# EAGLE design wifi_prod (EAGLE 6.3)
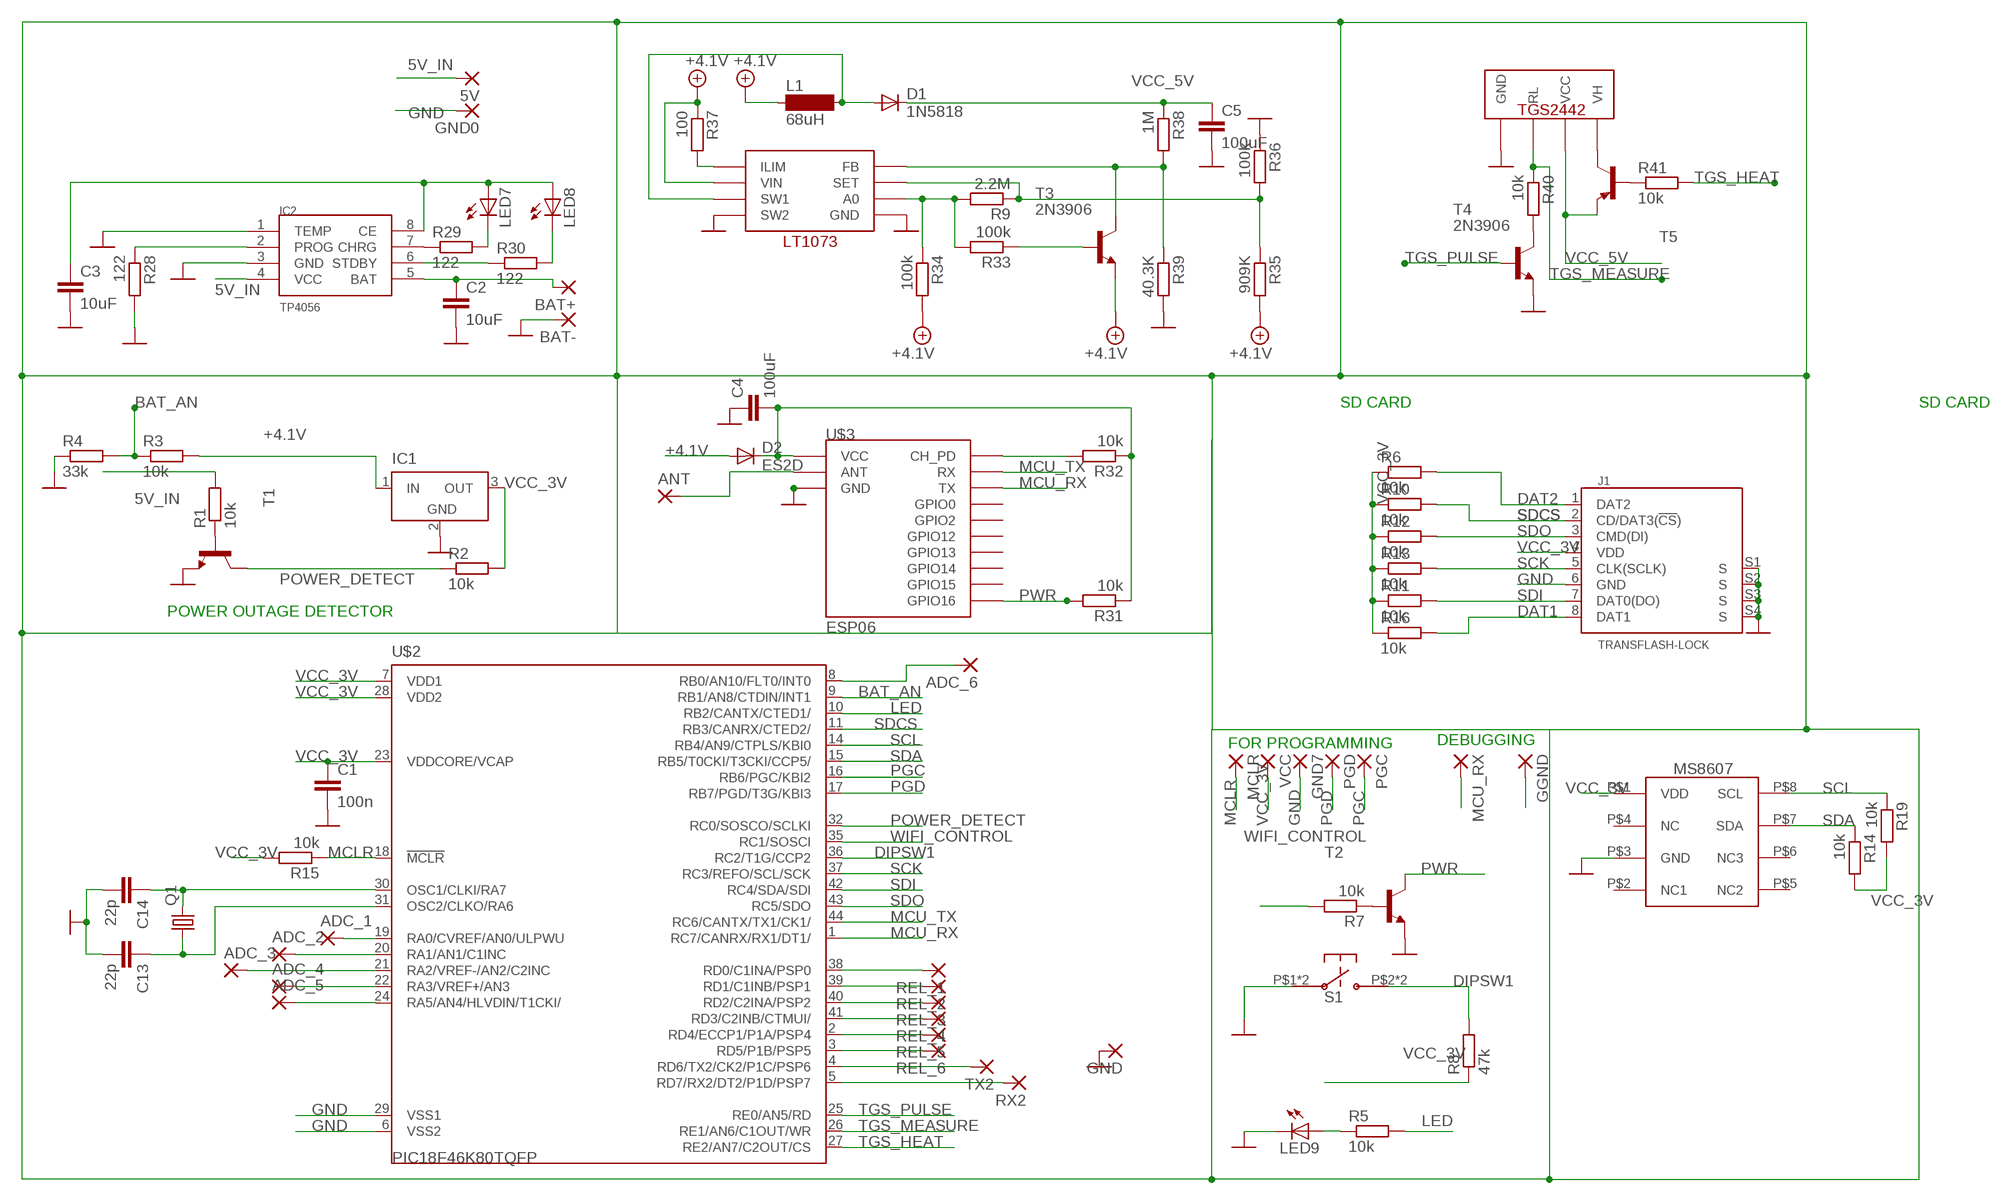
[diagram p0: schematic, sheet 1]

## Parts
5V  2,15/1,0  [2,15/1,0]
ADC_1  1,6/0,8  [1,6/0,8]
ADC_2  1,6/0,8  [1,6/0,8]
ADC_3  1,6/0,8  [1,6/0,8]
ADC_4  1,6/0,8  [1,6/0,8]
ADC_5  1,6/0,8  [1,6/0,8]
ADC_6  1,6/0,8  [1,6/0,8]
ANT  SMD2  [SMD1,27-2,54]
BAT+  2,15/1,0  [2,15/1,0]
BAT-  2,15/1,0  [2,15/1,0]
C1  100n  C-EUC0603  [C0603]
C2  10uF  C-EUC1206K  [C1206K]
C3  10uF  C-EUC1206K  [C1206K]
C4  100uF  C-EUC1206K  [C1206K]
C5  100uF  C-EUC1206K  [C1206K]
C13  22p  C-EUC1206K  [C1206K]
C14  22p  C-EUC1206K  [C1206K]
D1  1N5818  PMLL4150  [SOD80C]
D2  ES2D  [SMB]
GGND  2,15/1,0  [2,15/1,0]
GND  2,15/1,0  [2,15/1,0]
GND0  2,15/1,0  [2,15/1,0]
GND7  2,15/1,0  [2,15/1,0]
IC1  LT1129CST5  [SOT223]
IC2  TP4056  [SOP-8]
J1  TRANSFLASH-LOCK  [TRANSFLASH-LOCK-SOCK]
L1  68uH  MS85  [MS85]
LED7  LG_T679-E1F1-1  [PLCC2]
LED8  LG_T679-E1F1-1  [PLCC2]
LED9  LG_T679-E1F1-1  [PLCC2]
MCLR  2,15/1,0  [2,15/1,0]
MCU_RX  2,15/1,0  [2,15/1,0]
PGC  2,15/1,0  [2,15/1,0]
PGD  2,15/1,0  [2,15/1,0]
Q1  CRYSTALHC49S  [HC49/S]
R1  10k  R-EU_R0603  [R0603]
R2  10k  R-EU_R0603  [R0603]
R3  10k  R-EU_R0603  [R0603]
R4  33k  R-EU_R0603  [R0603]
R5  10k  R-EU_R0603  [R0603]
R6  10k  R-EU_R0603  [R0603]
R7  10k  R-EU_R0603  [R0603]
R8  47k  R-EU_R0603  [R0603]
R9  2.2M  R-EU_R0603  [R0603]
R10  10k  R-EU_R0603  [R0603]
R11  10k  R-EU_R0603  [R0603]
R12  10k  R-EU_R0603  [R0603]
R13  10k  R-EU_R0603  [R0603]
R14  10k  R-EU_R0603  [R0603]
R15  10k  R-EU_R0603  [R0603]
R16  10k  R-EU_R0603  [R0603]
R19  10k  R-EU_R0603  [R0603]
R28  122  R-EU_R0603  [R0603]
R29  122  R-EU_R0603  [R0603]
R30  122  R-EU_R0603  [R0603]
R31  10k  R-EU_R0603  [R0603]
R32  10k  R-EU_R0603  [R0603]
R33  100k  R-EU_R0603  [R0603]
R34  100k  R-EU_R0603  [R0603]
R35  909K  R-EU_R0603  [R0603]
R36  100k  R-EU_R0603  [R0603]
R37  100  R-EU_R0603  [R0603]
R38  1M  R-EU_R0603  [R0603]
R39  40.3K  R-EU_R0603  [R0603]
R40  10k  R-EU_R0603  [R0603]
R41  10k  R-EU_R0603  [R0603]
REL_1  1,6/0,8  [1,6/0,8]
REL_2  1,6/0,8  [1,6/0,8]
REL_3  1,6/0,8  [1,6/0,8]
REL_4  1,6/0,8  [1,6/0,8]
REL_5  1,6/0,8  [1,6/0,8]
REL_6  1,6/0,8  [1,6/0,8]
RX2  2,15/1,0  [2,15/1,0]
S1  EVQP2  [EVQP2]
T1  BC849  [SOT23]
T2  BC849  [SOT23]
T3  2N3906  BC847  [SOT23]
T4  2N3906  BC847  [SOT23]
T5  -PNP-SOT23-BCE  [SOT23-BCE]
TX2  2,15/1,0  [2,15/1,0]
U$1  LT1073  [LT1073]
U$2  PIC18F46K80TQFP  [TQFP44]
U$3  ESP06  [ESP06]
U$4  TGS2442  [TGS2442]
U$6  MS8607  [MS8607]
VCC  2,15/1,0  [2,15/1,0]

## Nets
5V_IN: 5V.1(P) C3.1 IC2.4(VCC) IC2.8(CE) LED7.A LED8.A R1.2
+4.1V: BAT+.1(P) C2.1 D2.A IC1.1(IN) IC2.5(BAT) L1.1 R3.2 R34.2 R35.2 R37.1 T3.2(E) U$1.P$2(VIN)
BAT_AN: R3.1 R4.2 U$2.9(RB1/AN8/CTDIN/INT1)
DAT1: J1.8(DAT1) R16.2
DAT2: J1.1(DAT2) R6.2
DIPSW1: R8.2 S1.P$2 S1.P$4 U$2.36(RC2/T1G/CCP2)
GND: BAT-.1(P) C1.2 C2.2 C3.2 C4.1 C5.2 C13.2 C14.2 GGND.1(P) GND0.1(P) GND7.1(P) GND.1(P) IC1.2(GND) IC2.1(TEMP) IC2.3(GND) J1.6(GND) J1.S1(S) J1.S2(S) J1.S3(S) J1.S4(S) LED9.C R4.1 R28.2 R36.1 R39.2 S1.P$1 S1.P$3 T1.2(E) T2.2(E) T4.2(E) U$1.P$4(SW2) U$1.P$5(GND) U$2.6(VSS2) U$2.29(VSS1) U$3.GND U$3.GND1(GND2) U$3.GND2(GND3) U$3.GND3(GND4) U$3.GND4(GND5) U$3.GND5(GND6) U$3.GND6(GND7) U$3.GND7(GND8) U$4.P$1(GND) U$6.P$3(GND)
LED: R5.2 U$2.10(RB2/CANTX/CTED1/)
MCLR: MCLR.1(P) R15.1 U$2.18(!MCLR)
MCU_RX: MCU_RX.1(P) U$2.1(RC7/CANRX/RX1/DT1/) U$3.TX
MCU_TX: U$2.44(RC6/CANTX/TX1/CK1/) U$3.RX
N$1: C4.2 D2.C R31.1 R32.1 U$3.VCC
N$2: ADC_1.1(P) U$2.19(RA0/CVREF/AN0/ULPWU)
N$3: R1.1 T1.1(B)
N$4: ADC_2.1(P) U$2.20(RA1/AN1/C1INC)
N$5: ADC_3.1(P) U$2.21(RA2/VREF-/AN2/C2INC)
N$6: R7.1 T2.1(B)
N$7: ADC_4.1(P) U$2.22(RA3/VREF+/AN3)
N$9: ADC_6.1(P) U$2.8(RB0/AN10/FLT0/INT0)
N$11: LED9.A R5.1
N$12: REL_1.1(P) U$2.38(RD0/C1INA/PSP0)
N$15: ADC_5.1(P) U$2.24(RA5/AN4/HLVDIN/T1CKI/)
N$18: C13.1 Q1.1 U$2.31(OSC2/CLKO/RA6)
N$19: TX2.1(P) U$2.4(RD6/TX2/CK2/P1C/PSP6)
N$22: C14.1 Q1.2 U$2.30(OSC1/CLKI/RA7)
N$24: REL_2.1(P) U$2.39(RD1/C1INB/PSP1)
N$25: REL_3.1(P) U$2.40(RD2/C2INA/PSP2)
N$26: REL_4.1(P) U$2.41(RD3/C2INB/CTMUI/)
N$27: REL_5.1(P) U$2.2(RD4/ECCP1/P1A/PSP4)
N$28: REL_6.1(P) U$2.3(RD5/P1B/PSP5)
N$29: R9.2 R33.2 R34.1 U$1.P$6(A0)
N$30: RX2.1(P) U$2.5(RD7/RX2/DT2/P1D/PSP7)
N$34: ANT.1(P) U$3.ANT
N$35: IC2.2(PROG) R28.1
N$36: IC2.7(CHRG) R29.1
N$37: IC2.6(STDBY) R30.1
N$38: LED7.C R29.2
N$39: LED8.C R30.2
N$40: R32.2 U$3.CH_PD
N$41: R9.1 R35.1 R36.2 U$1.P$7(SET)
N$42: R33.1 T3.1(B)
N$43: R38.2 R39.1 T3.3(C) U$1.P$8(FB)
N$44: T5.C U$4.P$4(VH)
N$45: R37.2 U$1.P$1(ILIM)
N$46: R40.2 T4.3(C)
N$47: D1.A L1.2 U$1.P$3(SW1)
N$48: R41.1 T5.B
PGC: PGC.1(P) U$2.16(RB6/PGC/KBI2)
PGD: PGD.1(P) U$2.17(RB7/PGD/T3G/KBI3)
POWER_DETECT: R2.1 T1.3(C) U$2.32(RC0/SOSCO/SCLKI)
PWR: R31.2 T2.3(C) U$3.GPIO16
SCK: J1.5(CLK(SCLK)) R13.2 U$2.37(RC3/REFO/SCL/SCK)
SCL: R19.1 U$2.14(RB4/AN9/CTPLS/KBI0) U$6.P$8(SCL)
SDA: R14.1 U$2.15(RB5/T0CKI/T3CKI/CCP5/) U$6.P$7(SDA)
SDCS: J1.2(CD/DAT3(!CS!)) R10.2 U$2.11(RB3/CANRX/CTED2/)
SDI: J1.7(DAT0(DO)) R11.2 U$2.42(RC4/SDA/SDI)
SDO: J1.3(CMD(DI)) R12.2 U$2.43(RC5/SDO)
TGS_HEAT: R41.2 U$2.27(RE2/AN7/C2OUT/CS)
TGS_MEASURE: R40.1 U$2.26(RE1/AN6/C1OUT/WR) U$4.P$2(RL)
TGS_PULSE: T4.1(B) U$2.25(RE0/AN5/RD)
VCC_3V: C1.1 IC1.3(OUT) J1.4(VDD) R2.2 R6.1 R8.1 R10.1 R11.1 R12.1 R13.1 R14.2 R15.2 R16.1 R19.2 U$2.7(VDD1) U$2.23(VDDCORE/VCAP) U$2.28(VDD2) U$6.P$1(VDD) VCC.1(P)
VCC_5V: C5.1 D1.C R38.1 T5.E U$4.P$3(VCC)
WIFI_CONTROL: R7.2 U$2.35(RC1/SOSCI)
Unconnected: U$3.GPIO0 U$3.GPIO2 U$3.GPIO12 U$3.GPIO13 U$3.GPIO14 U$3.GPIO15 U$6.P$2(NC1) U$6.P$4(NC) U$6.P$5(NC2) U$6.P$6(NC3)

## Notes on the sheet
- SD CARD | SD CARD
- POWER OUTAGE DETECTOR
- FOR PROGRAMMING | DEBUGGING

## Power pins joined to a net without a drawn wire
GND: IC1.4(GND)

## Library data of the parts
5V BAT+ BAT- GGND GND GND0 GND7 MCLR MCU_RX PGC PGD RX2 TX2 VCC = wirepad:2,15/1,0: THROUGH-HOLE PAD
ADC_1-ADC_6 REL_1-REL_6 = wirepad:1,6/0,8: THROUGH-HOLE PAD
ANT = wirepad:SMD2: SMD PAD
C1-C5 C13 C14 = rcl:C-EU: CAPACITOR, European symbol
D1 = diode:PMLL4150: DIODE high speed
D2 = diode:ES2D: DIODE super fast rectifier, 2 A
IC1 = linear-technology:LT1129CST5: VOLTAGE REGULATOR with shutdown; MPN: LT1129CST-5#PBF; OC_FARNELL: 1663375; OC_NEWARK: 57M2069
IC2 = TP4056:TP4056
J1 = sd-mmc:TRANSFLASH: TransFlash TF Micro SD Card Socket Adapter
L1 = inductor-neosid:MS85: INDUCTOR SMD power inductor; OC_FARNELL: unknown; OC_NEWARK: unknown
LED7-LED9 = led:*_T679-?-1: LC TOPLED® Low Current LED Source: http://catalog.osram-os.com .. LG_LS_LY_T679_OBS.pdf; COLOR: green
Q1 = crystal:CRYSTAL: CRYSTAL; OC_FARNELL: 1667008; OC_NEWARK: unknown
R1-R16 R19 R28-R41 = rcl:R-EU_: RESISTOR, European symbol
S1 = switches:EVQP2: SWITCH TACTILE SPST-NO 0.02A 15V; DIGIKEY: P11084SCT-ND
T1 T2 = transistor:BC849: NPN TRANSISTOR
T3 T4 = transistor:BC847: NPN TRANSISTOR
T5 = transistor:*-PNP-: PNP Transistror
U$1 = LT1073:LT1073
U$2 = microchip:PIC18F46K80TQFP
U$3 = esp8266modules:ESP06: ESP8266 Wifi module 06
U$4 = TGS2442:TGS2442
U$6 = MS8607:MS8607

## Net classes
0 default: clearance 0.355 mm

## Board
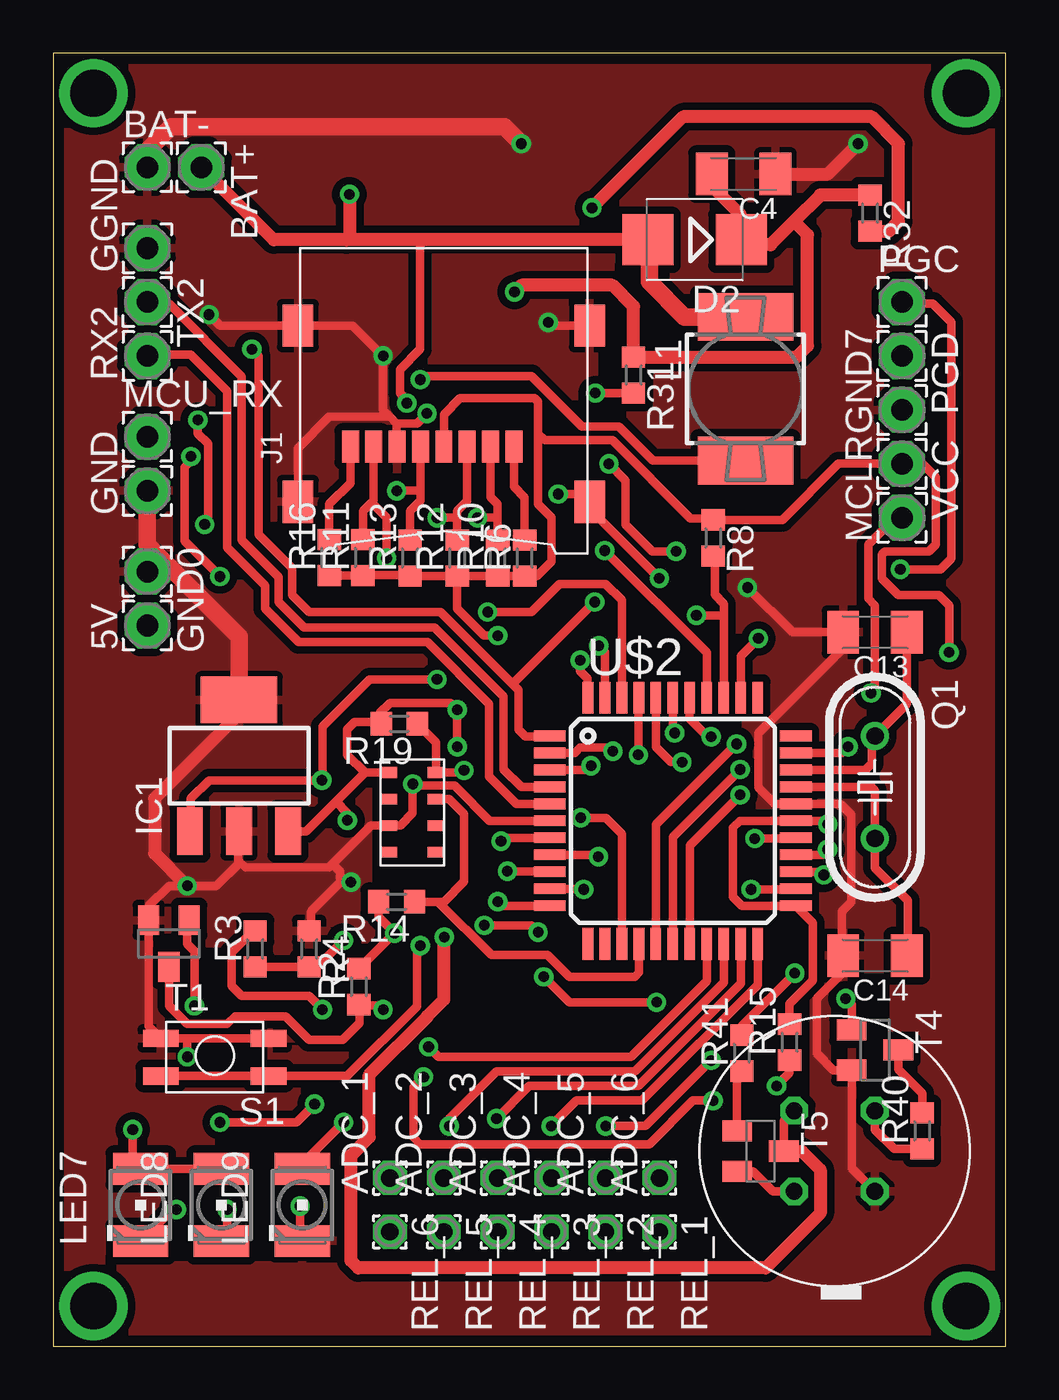
[diagram p1: board, top side]
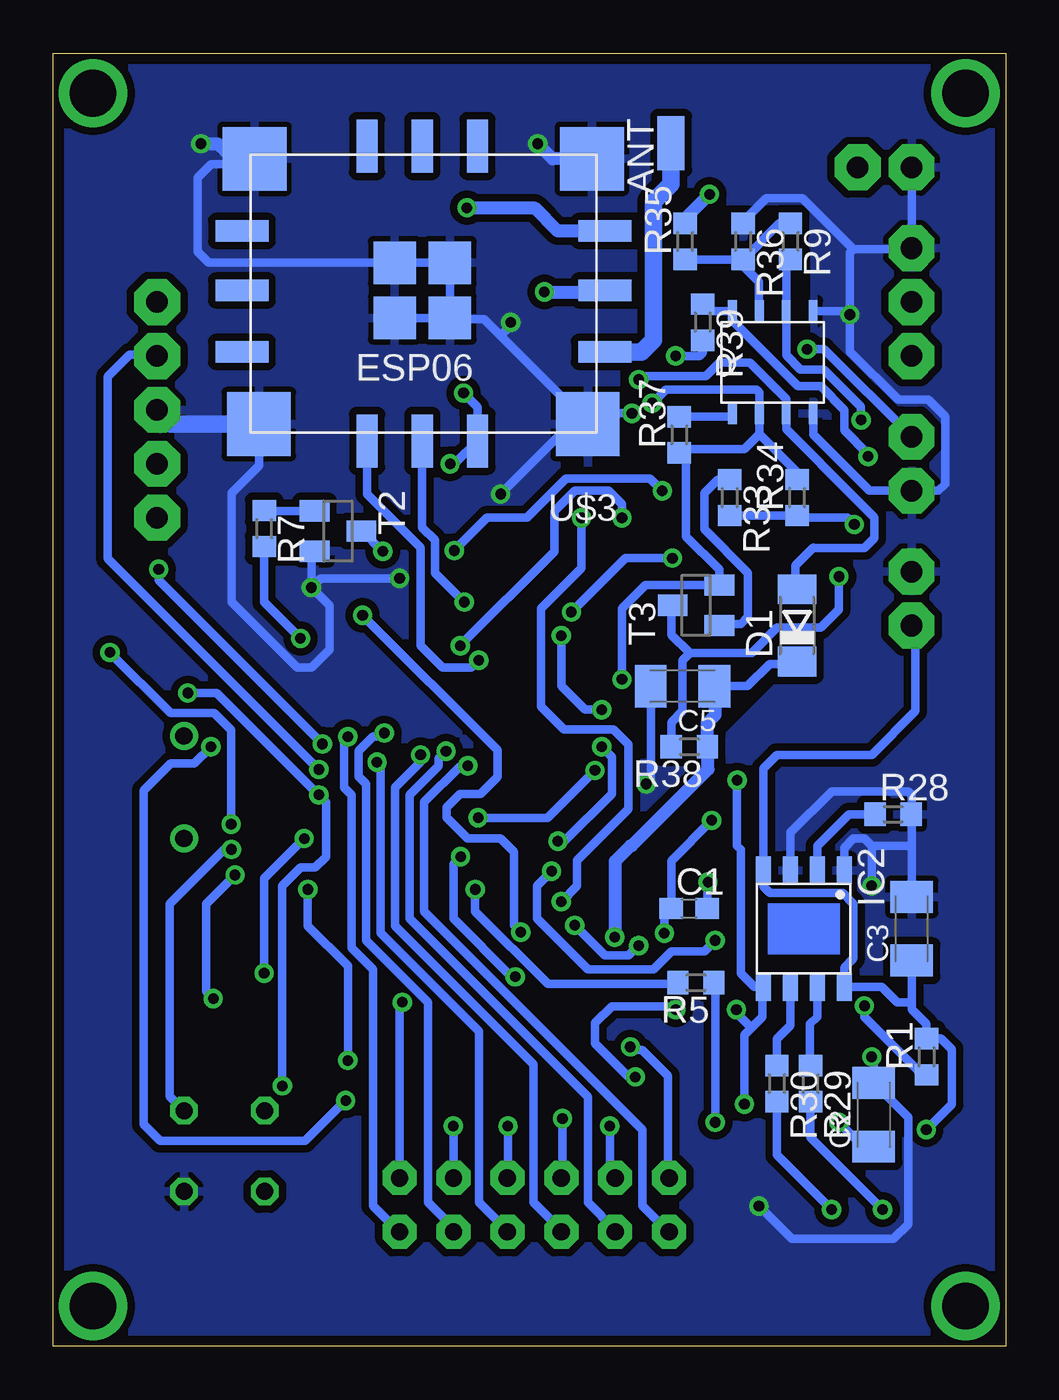
[diagram p2: board, bottom side, seen from below]

Size 44.91 x 60.95 mm. Coordinates in mm from the lower left corner, seen from the top.
Outline: 0,0 44.91,0 44.91,60.95 0,60.95 0,0
Copper layers (1*16): Top 0.035mm / dielectric 1.5mm / Bottom 0.035mm
Design rules "default *": minimum track width 7mil, minimum drill 24mil, track to track 1mil, track to pad 1mil, pad to pad 1mil, via to via 1mil, smd to smd 1mil, copper to edge 20mil, drill to drill 3mil, minimum pad ring 10mil, minimum via ring 8mil, stop-mask expansion 4mil, vias tented up to drill 0mil, thermal gap 10mil
tRestrict: area 10.1,36.8 to 12.7,38.8; area 22.8,35.9 to 26.7,42.1; area 24.5,34.2 to 31.2,39.7; area 25.7,44.5 to 28.3,49.1; area 33.4,53.1 to 34.8,54.5; area 18.8,23.4 to 22.3,27.2; area 14.6,26.5 to 18.7,29.1; area 15.1,22.7 to 19.4,26.7; area 15.1,20.8 to 19.5,23.2; area 6.3,15.7 to 9.2,18.8; area 5.8,13.1 to 10.1,15.2; area 7.9,5.8 to 13.9,8.2; 9 more areas
bRestrict: area 5.1,9.9 to 9.8,16; area 3.2,9.9 to 7.2,12.8; area 12.5,20.3 to 15.9,24.3; area 12.7,20 to 16.8,25; area 15.4,27.7 to 20,35.2; area 32.4,36.8 to 34.8,38.8; area 5.3,39.7 to 10.3,43.6; area 12.2,45.5 to 16.4,51; area 16.4,44.2 to 18.2,45.7; area 9.2,47.4 to 11,51.7; area 10.4,52.7 to 14.6,53.8; area 12.8,51.4 to 14.7,53.6; 2 more areas; 2 lines

### Footprints (pad centres in the part's own frame; a part is rotated, then mirrored left to right if it is on the bottom)
2,15/1,0 = drill 1.016 pad 2.159 octagon: 1 0,0
1,6/0,8 = drill 0.813 pad 1.6 octagon: 1 0,0
SMD1,27-2,54 = smd 1.27 x 2.54: 1 0,0
C0603 = smd 1.1 x 1: 1 -0.85,0; 2 0.85,0
C1206K = smd 1.5 x 2: 1 -1.5,0; 2 1.5,0
SOD80C = smd 1.4 x 1.8: A 1.7,0; C -1.7,0
SMB = smd 2.4 x 2.4: A 2.2,0; C -2.2,0
SOT223 = smd 1.219 x 2.235: 1 -2.311,-3.099; 2 0,-3.099; 3 2.311,-3.099 | smd 3.6 x 2.2: 4 0,3.099
SOP-8 = smd 1.3 x 0.7: 1 -2.75,1.905; 2 -2.75,0.635; 3 -2.75,-0.635; 4 -2.75,-1.905; 5 2.75,-1.905; 6 2.75,-0.635; 7 2.75,0.635; 8 2.75,1.905
TRANSFLASH-LOCK-SOCK = smd 0.8 x 1.5: 1 3.3,-0.46; 2 2.2,-0.46; 3 1.1,-0.46; 4 0,-0.46; 5 -1.1,-0.46; 6 -2.2,-0.46; 7 -3.3,-0.46; 8 -4.4,-0.46 | smd 1.45 x 2: S1 -6.875,-3.06; S2 -6.875,5.24; S3 6.875,5.24; S4 6.875,-3.06
MS85 = smd 4.5 x 2.25: 1 0,-3.383; 2 0,3.383
PLCC2 = smd 2.6 x 1.5: A 0,1.7; C 0,-1.7
HC49/S = drill 0.813: 1 -2.413,0; 2 2.413,0
R0603 = smd 1 x 1.1: 1 -0.85,0; 2 0.85,0
EVQP2 = smd 1.676 x 0.813: P$1 -2.54,-0.87; P$2 -2.54,0.908; P$3 2.54,-0.87; P$4 2.54,0.908
SOT23 = smd 1 x 1.4: 1 -0.95,-1.1; 2 0.95,-1.1; 3 0,1.1
SOT23-BCE = smd 1 x 1.4: B -0.95,-1.1; C 0.95,-1.1; E 0,1.1
LT1073 = smd 0.406 x 1.016: P$1 0.508,-0.512; P$2 1.778,-0.512; P$3 3.048,-0.512; P$4 4.318,-0.512; P$5 4.318,4.314; P$6 3.048,4.314; P$7 1.778,4.314; P$8 0.508,4.314
TQFP44 = smd 1.5 x 0.5: 1 -5.8,4; 2 -5.8,3.2; 3 -5.8,2.4; 4 -5.8,1.6; 5 -5.8,0.8; 6 -5.8,0; 7 -5.8,-0.8; 8 -5.8,-1.6; 9 -5.8,-2.4; 10 -5.8,-3.2; 11 -5.8,-4; 23 5.8,-4; 24 5.8,-3.2; 25 5.8,-2.4; 26 5.8,-1.6; 27 5.8,-0.8; 28 5.8,0; 29 5.8,0.8; 30 5.8,1.6; 31 5.8,2.4; 32 5.8,3.2; 33 5.8,4 | smd 0.5 x 1.5: 12 -4,-5.8; 13 -3.2,-5.8; 14 -2.4,-5.8; 15 -1.6,-5.8; 16 -0.8,-5.8; 17 0,-5.8; 18 0.8,-5.8; 19 1.6,-5.8; 20 2.4,-5.8; 21 3.2,-5.8; 22 4,-5.8; 34 4,5.8; 35 3.2,5.8; 36 2.4,5.8; 37 1.6,5.8; 38 0.8,5.8; 39 0,5.8; 40 -0.8,5.8; 41 -1.6,5.8; 42 -2.4,5.8; 43 -3.2,5.8; 44 -4,5.8
ESP06 = smd 2.5 x 1: ANT -8.4,3.3; CH_PD -8.4,-2.4; GPIO0 8.7,3.3; GPIO2 8.7,0.4; GPIO15 8.7,-2.4; VCC -8.4,0.4 | smd 3 x 3: GND -7.6,6.7; GND1 -7.8,-5.8; GND2 8.1,-5.8; GND3 7.9,6.7 | smd 2 x 2: GND4 -1.1,1.7; GND5 1.5,1.7; GND6 1.5,-0.9; GND7 -1.1,-0.9 | smd 1 x 2.5: GPIO12 0.2,-6.4; GPIO13 2.8,-6.4; GPIO14 -2.4,-6.4; GPIO16 -2.4,7.5; RX 2.8,7.5; TX 0.2,7.5
TGS2442 = drill 0.8 octagon: P$1 -2.54,2.54; P$2 -2.54,-1.27; P$3 1.27,-1.27; P$4 1.27,2.54
MS8607 = smd 0.8 x 0.5: P$1 0.375,4.375; P$2 0.375,3.125; P$3 0.375,1.875; P$4 0.375,0.625; P$5 2.625,0.625; P$6 2.625,1.875; P$7 2.625,3.125; P$8 2.625,4.375

### Placement (x,y rotation side)
5V  4.45,33.97 90 top
ADC_1  15.88,7.94 90 top
ADC_2  18.42,7.94 90 top
ADC_3  20.95,7.94 90 top
ADC_4  23.5,7.94 90 top
ADC_5  26.03,7.94 90 top
ADC_6  28.58,7.94 90 top
ANT  15.78,56.7 0 bottom
BAT+  6.98,55.56 270 top
BAT-  4.45,55.56 0 top
C1  14.92,20.64 0 bottom
C2  6.23,10.92 90 bottom
C3  4.45,19.68 90 bottom
C4  32.54,55.25 180 top
C5  15.24,31.11 180 bottom
C13  38.73,33.66 180 top
C14  38.73,18.42 180 top
D1  9.84,33.97 90 bottom
D2  30.23,52.15 180 top
GGND  4.45,51.75 90 top
GND  4.45,40.32 90 top
GND0  4.45,36.51 270 top
GND7  40,44.13 90 top
IC1  8.76,27.37 0 top
IC2  9.53,19.68 270 bottom
J1  18.42,42.86 0 top
L1  32.63,45.13 180 top
LED7  4.13,6.67 0 top
LED8  7.94,6.67 0 top
LED9  11.75,6.67 0 top
MCLR  40,39.05 90 top
MCU_RX  4.45,42.86 0 top
PGC  40,49.21 0 top
PGD  40,46.67 270 top
Q1  38.73,26.35 270 top
R1  3.74,13.65 90 bottom
R2  14.41,16.95 90 top
R3  9.53,18.73 90 top
R4  12.06,18.73 270 top
R5  14.61,17.14 180 bottom
R6  22.22,37.15 90 top
R7  34.95,38.54 270 bottom
R8  31.11,38.1 270 top
R9  10.16,52.07 270 bottom
R10  20.95,37.15 90 top
R11  14.61,37.17 90 top
R12  19.05,37.15 90 top
R13  16.83,37.15 90 top
R14  16.19,20.96 180 top
R15  34.71,14.34 90 top
R16  13.02,37.17 90 top
R19  16.32,29.34 180 top
R28  5.31,25.08 0 bottom
R29  9.21,12.38 270 bottom
R30  10.8,12.38 270 bottom
R31  27.36,45.77 270 top
R32  38.5,53.4 270 top
R33  13.02,40.01 270 bottom
R34  9.84,40.01 90 bottom
R35  15.12,52.07 90 bottom
R36  12.38,52.07 270 bottom
R37  15.39,42.96 90 bottom
R38  14.92,28.26 180 bottom
R39  14.29,48.26 270 bottom
R40  40.96,10.16 90 top
R41  32.46,13.82 90 top
REL_1  28.58,5.4 270 top
REL_2  26.03,5.4 270 top
REL_3  23.5,5.4 270 top
REL_4  20.95,5.4 270 top
REL_5  18.42,5.4 270 top
REL_6  15.88,5.4 270 top
RX2  4.45,46.67 90 top
S1  7.62,13.65 180 top
T1  5.46,18.99 180 top
T2  31.48,38.42 270 bottom
T3  14.61,34.92 90 bottom
T4  38.73,13.97 270 top
T5  33.34,9.21 270 top
TX2  4.45,49.21 270 top
U$1  13.4,44.47 0 bottom
U$2  29.21,24.76 0 top
U$3  27.31,50.17 180 bottom
U$4  36.2,9.84 180 top
U$6  15.43,22.67 0 top
VCC  40,41.59 270 top

### Tracks (layer width: path | path; a pad name or v marks a point on that pad's centre or on a via)
5V_IN  (via drill 0.5 pad 0.25)
  Top 0.406: v3.75,10.22 3.75,8.74 LED7.A LED8.A
  Bottom 0.406: C3.1 4.45,16.22 | 4.45,16.22 4.45,15.88 3.75,15.19 3.75,14.52 | 3.75,14.52 R1.2 | 3.75,14.52 3.08,14.52 2.55,13.99 2.55,11.42 v3.75,10.22 | 4.45,16.22 5.12,16.22 5.84,16.93 IC2.8 7.62,17.84 7.18,18.28 7.18,20.85 7.7,21.36 11.12,21.36 11.43,21.67 IC2.4 11.43,27.23 10.78,27.88 6.33,27.88 4.27,29.93 4.27,33.79 5V.1
+4.1V  (via drill 0.5 pad 0.25)
  Top 0.406: v7.87,10.56 11.47,10.56 v12.33,11.42 | IC1.1 6.5,24.31 6.5,25.82 7.35,26.68 v12.67,26.68 12.7,26.71 12.7,29.21 14.92,31.43 v18.1,31.43 | R3.2 9.42,19.58 8.41,18.57 8.41,16.99 8.89,16.51 12.06,16.51 v12.7,15.87 | v16.67,44.45 16.67,44.61 16.35,44.93 16.35,46.04 17.3,46.99 17.3,51.99 17.46,52.15
  Top 0.61: D2.A 17.46,52.15 13.81,52.15 | 13.81,52.15 10.4,52.15 BAT+.1 | v13.97,54.29 13.97,52.3 13.81,52.15
  Top 0.813: L1.1 29.75,48.51 28.1,50.17 28.1,52.08 D2.A 28.42,52.71
  Bottom 0.406: 11.62,42.98 U$1.P$2 11.62,44.96 11.75,45.09 16.03,45.09 v16.67,44.45 | 11.62,42.98 12.33,42.28 15.22,42.28 R37.1 15.07,41.78 15.07,38.16 13.5,36.6 T3.2 16.99,35.87 18.1,34.77 v18.1,31.43 | R34.2 9.84,41.21 11.62,42.98 | 15.07,52.97 R35.2 | C2.1 6.72,9.42 v7.87,10.56 | v12.33,11.42 12.33,14.67 11.99,15.01 | 11.99,15.01 11.47,15.53 11.47,16.9 IC2.5 11.84,16.93 12.5,17.59 12.5,23.42 12.67,23.59 v12.67,26.68 | v12.7,15.87 12.7,15.72 11.99,15.01
  Bottom 0.61: 15.07,52.97 15.07,53.19 v13.97,54.29
BAT_AN  (via drill 0.5 pad 0.25)
  Top 0.406: R3.1 R4.2 12.45,17.88 v13.7,19.13 | v21.41,22.39 23.39,22.39 U$2.9
  Bottom 0.406: v21.41,22.39 22.1,21.7 22.1,20.16 19.7,17.76 16.61,17.76 15.75,18.62 14.21,18.62 v13.7,19.13
DAT1
  Top 0.406: J1.8 14.02,40.68 13.02,39.69 R16.2
DAT2
  Top 0.406: J1.1 21.72,40.51 22.22,40.01 R6.2
DIPSW1  (via drill 0.5 pad 0.25)
  Top 0.406: S1.P$4 S1.P$2 13.86,12.74 17.14,16.03 17.14,18.73 v17.3,18.89 | U$2.36 31.61,34.29 | 31.61,34.29 31.61,35 31.19,35.42 31.19,37.18 R8.2 | v20.32,19.84 22.54,19.84 v22.86,19.53 | v30.32,34.45 31.45,34.45 31.61,34.29
  Bottom 0.406: v17.3,18.89 17.78,18.42 18.89,18.42 v20.32,19.84 | v22.86,19.53 23.18,19.84 23.18,23.3 23.81,23.93 25.36,23.93 26.35,24.92 26.35,25.4 25.72,26.04 24.77,26.04 23.97,26.83 23.97,28.1 v30.32,34.45
GND  (via drill 0.5 pad 0.25)
  Top 0.406: J1.S1 11.54,42.34 13.02,43.81 15.88,43.81 | 15.88,43.81 16.19,43.5 | 16.19,43.5 16.19,42.42 J1.6 | 15.88,43.81 15.56,44.13 v15.56,46.67 14.13,48.1 J1.S2 7.87,48.1 v7.35,48.62 | 13.18,22.73 14.99,24.54 U$6.P$3 16.37,24.54 16.95,25.13 v16.95,26.5 17.03,26.43 18.92,26.43 19.01,26.34 19.01,26.33 20.58,24.76 U$2.6 | 13.18,22.73 13.01,22.56 9.07,22.56 8.81,22.82 | 8.81,22.82 8.72,22.9 8.72,24.23 IC1.2 | 6.33,14.52 S1.P$3 4.51,15.09 T1.2 4.51,20.75 5.47,21.7 v6.33,21.7 7.7,21.7 8.81,22.82 | 6.33,14.52 S1.P$1 | v6.33,13.65 6.33,14.52 | v32.73,35.76 34.84,33.65 C13.2 37.19,34.24 37.19,32.85 33.24,28.91 33.24,26.33 34.01,25.57 U$2.29 37.1,25.57 37.62,25.04 37.62,20.94 37.19,20.5 37.19,18.46 C14.2 37.23,17.64 35.98,16.39 35.98,13.82 36.78,13.02 T4.2 37.64,8.4 U$4.P$1 | v11.64,6.62 11.64,5.08 LED9.C | R4.1 12.15,19.67 12.15,20.5 13.53,21.88 | 13.53,21.88 v14.04,21.88 | 13.53,21.88 13.53,22.39 13.18,22.73 | v28.58,36.19 25.29,39.48 J1.S4 24.93,40.16 v23.81,40.16 | J1.S3 23.49,48.1 v23.34,48.26 | 16.19,43.5 17.14,43.5 v17.62,43.97
  Top 0.61: IC1.4 8.76,29.8 4.78,25.82 4.78,23.25 v6.33,21.7 | C4.1 36.51,55.25 v37.94,56.67
  Top 0.813: IC1.4 8.76,33.46 5.72,36.51 | 5.72,36.51 GND0.1 | GND.1 4.45,37.78 5.72,36.51 | v22.07,56.67 21.27,57.47 5.56,57.47 4.45,56.36 BAT-.1
  Bottom 0.406: v6.33,13.65 6.23,13.55 C2.2 4.61,10.8 4.61,5.76 5.3,5.07 10.1,5.07 v11.64,6.62 | U$3.GND4 U$3.GND7 U$3.GND6 37.57,51.06 38.1,51.59 38.1,55.09 37.47,55.72 36.2,55.72 35.65,55.72 U$3.GND2 35.1,55.97 | U$3.GND4 U$3.GND5 | v32.73,35.76 32.73,37.32 T2.2 | U$1.P$4 9.07,43.95 9.07,42.96 6.43,40.32 GND.1 3.17,40.32 2.86,40.64 2.86,43.81 3.65,44.61 5.08,44.61 7.35,46.88 v7.35,48.62 | 7.18,51.71 4.49,51.71 GGND.1 BAT-.1 | R36.1 12.38,53.02 11.3,54.11 9.58,54.11 7.18,51.71 | 10.16,23.36 IC2.3 10.16,24.21 8.21,26.16 4.61,26.16 4.44,25.99 4.44,25.1 R28.2 4.45,25.06 4.45,23.59 | C1.2 14.07,21.84 v14.04,21.88 | U$3.GND3 35.2,41.52 36.5,40.22 36.5,35.08 33.41,31.99 32.73,31.99 31.87,32.85 31.87,34.91 v32.73,35.76 | C5.2 16.74,26.72 v16.95,26.5 | v28.58,36.19 32.3,36.19 v32.73,35.76 | 20.51,43.47 U$3.GND 19.2,43.97 v17.62,43.97 | 20.51,43.47 v23.81,40.16 | 20.51,43.47 20.51,44.32 23.81,47.62 | 23.81,47.62 24.61,48.42 26.16,48.42 U$3.GND4 | v23.34,48.26 23.34,48.1 23.81,47.62 | U$1.P$5 7.52,48.79 v7.35,48.62 | v15.56,46.67 14.45,46.67 14.29,46.83 R39.2 | v7.35,48.62 7.35,51.54 7.18,51.71 | IC2.1 7.62,23.5 7.18,23.93 6.67,23.93 6.33,23.59 | C3.2 4.45,23.59 | 6.33,23.59 4.45,23.59 | 6.33,23.59 v6.33,21.7
  Bottom 0.61: v37.94,56.67 37.15,56.67 36.2,55.72 | U$3.GND1 21.36,55.97 v22.07,56.67
  Bottom 0.813: U$3.GND3 39.34,43.47 GND7.1
  pour Bottom: -0.02,60.79 44.9,60.79 44.9,0.1 -0.02,0.1
  pour Top: -0.02,0.1 44.9,0.1 44.9,60.97 -0.02,60.97
LED  (via drill 0.5 pad 0.25)
  Top 0.406: U$2.10 24.98,21.57 v25.01,21.53
  Bottom 0.406: v25.01,21.53 25.01,20.5 21.58,17.08 15.53,17.08 R5.2
MCLR  (via drill 0.5 pad 0.25)
  Top 0.406: R15.1 34.71,12.88 v34.1,12.27 | v32.39,25.99 30.01,23.62 U$2.18 | 38.73,30.96 v38.56,30.79 38.73,30.97 38.73,34.93 38.42,35.24 38.42,37.78 39.69,39.05 MCLR.1
  Bottom 0.406: v34.1,12.27 34.1,21.7 33.24,22.56 32.56,22.56 32.04,23.08 32.04,25.65 v32.39,25.99 37.19,30.79 v38.56,30.79
MCU_RX  (via drill 0.5 pad 0.25)
  Top 0.406: U$2.1 23.38,28.73 22.27,28.73 21.93,29.08 21.93,30.94 21.66,31.21 | 21.66,31.21 v25.53,35.08 | 21.66,31.21 18.26,34.61 12.06,34.61 11.27,35.4 11.27,36.67 9.68,38.26 9.68,46.67 v9.37,46.99
  Bottom 0.406: U$3.TX 27.5,38.6 26.9,37.99 26.9,36.45 v25.53,35.08 | v9.37,46.99 8.57,46.99 MCU_RX.1
MCU_TX  (via drill 0.5 pad 0.25)
  Top 0.406: v24.84,32.33 24.84,31.82 25.18,31.48 25.18,30.59 U$2.44
  Bottom 0.406: U$3.RX 30.11,40.17 27.58,37.65 27.58,33.02 26.56,31.99 25.18,31.99 v24.84,32.33
N$1  (via drill 0.5 pad 0.25)
  Top 0.61: v21.75,49.69 22.07,50.01 26.35,50.01 27.36,49 R31.1 35.03,46.62 35.56,47.15 35.56,52.39 34.92,53.02 | R32.1 36.16,54.25 34.92,53.02 | 34.92,53.02 33.81,51.91 32.67,51.91 D2.C 32.39,52.19 32.39,53.34 31.04,54.68 C4.2
  Bottom 0.61: v21.75,49.69 18.98,49.69 U$3.VCC
N$2  (via drill 0.5 pad 0.25)
  Top 0.406: U$2.19 30.81,17.21 27.24,13.65 18.17,13.65 v17.7,14.12
  Bottom 0.406: ADC_1.1 15.93,7.99 15.93,12.75 17.14,13.97 17.55,13.97 v17.7,14.12
N$3  (via drill 0.5 pad 0.25)
  Top 0.406: v6.67,16.05 6.67,18.62 6.33,18.96 6.33,20 T1.1
  Bottom 0.406: R1.1 3.94,12.8 6.67,15.53 v6.67,16.05
N$4  (via drill 0.5 pad 0.25)
  Top 0.406: U$2.20 31.61,17.16 27.41,12.96 20.9,12.96 18.67,10.73 v18.67,10.39
  Bottom 0.406: v18.67,10.39 18.67,8.19 ADC_2.1
N$5  (via drill 0.5 pad 0.25)
  Top 0.406: U$2.21 32.41,17.1 27.58,12.27 22.44,12.27 v20.9,10.73 21.24,11.07
  Bottom 0.406: v20.9,10.73 20.9,7.99 ADC_3.1
N$6
  Bottom 0.406: T2.1 34.94,39.37 R7.1
N$7  (via drill 0.5 pad 0.25)
  Top 0.406: U$2.22 33.21,17.04 27.76,11.59 24.67,11.59 v23.47,10.39
  Bottom 0.406: v23.47,10.39 23.47,7.96 ADC_4.1
N$9  (via drill 0.5 pad 0.25)
  Top 0.406: v28.44,16.22 24.33,16.22 v23.13,17.42 | U$2.8 25.61,23.17 v25.7,23.08
  Bottom 0.406: ADC_6.1 28.58,16.08 v28.44,16.22 | v23.13,17.42 23.3,17.42 26.04,20.16 26.04,22.73 v25.7,23.08
N$11  (via drill 0.5 pad 0.25)
  Top 0.406: LED9.A 11.75,8.61 v13.7,10.56
  Bottom 0.406: v13.7,10.56 13.7,17.09 R5.1
N$12  (via drill 0.5 pad 0.25)
  Top 0.406: v31.01,28.73 30.84,28.73 29.98,29.59 29.98,30.54 U$2.38
  Bottom 0.406: REL_1.1 28.59,5.4 29.81,6.62 29.81,17.76 30.84,18.79 30.84,25.99 31.19,26.33 31.19,28.56 v31.01,28.73
N$13  (via drill 2.2 pad 0.25)
  other vias: 43.02,59.06
N$14  (via drill 2.2 pad 0.25)
  other vias: 1.91,59.06
N$15  (via drill 0.5 pad 0.25)
  Top 0.406: v32.9,21.53 34.98,21.53 U$2.24 | v26.04,10.39 27.93,10.39 v31.01,13.47
  Bottom 0.406: ADC_5.1 v26.03,10.38 v26.04,10.39 | v31.01,13.47 31.01,17.93 32.9,19.82 v32.9,21.53
N$16  (via drill 2.2 pad 0.25)
  other vias: 43.02,1.9
N$17  (via drill 2.2 pad 0.25)
  other vias: 1.91,1.9
N$18
  Top 0.406: C13.1 40.23,30.27 Q1.1 38.58,28.61 38.58,27.46 38.28,27.17 U$2.31
N$19
  Top 0.406: U$2.4 22.07,26.36 21.24,27.19 21.24,30.62 17.98,33.88 11.84,33.88 10.64,35.08 10.64,36.25 8.9,37.99 8.9,45.71 5.47,49.14 4.52,49.14 TX2.1
N$22
  Top 0.406: C14.1 40.27,18.45 40.27,21.02 38.73,22.56 Q1.2 38.73,26.19 38.56,26.36 U$2.30
N$24  (via drill 0.5 pad 0.25)
  Top 0.406: U$2.39 29.21,28.99 v29.3,28.91
  Bottom 0.406: REL_2.1 26.03,5.58 27.24,6.79 27.24,16.22 30.16,19.13 30.16,26.5 30.5,26.85 30.5,28.05 29.81,28.73 29.47,28.73 v29.3,28.91
N$25  (via drill 0.5 pad 0.25)
  Top 0.406: v29.64,27.53 29.13,27.53 28.41,28.25 U$2.40
  Bottom 0.406: REL_3.1 23.5,5.44 24.84,6.79 24.84,14.85 29.47,19.48 29.47,27.36 v29.64,27.53
N$26  (via drill 0.5 pad 0.25)
  Top 0.406: U$2.41 27.58,30.54 v27.58,27.88
  Bottom 0.406: REL_4.1 20.95,5.47 22.27,6.79 22.27,13.3 28.78,19.82 28.78,26.33 27.58,27.53 v27.58,27.88
N$27  (via drill 0.5 pad 0.25)
  Top 0.406: U$2.2 24.59,27.97 24.84,28.22 26.21,28.22 v26.38,28.05
  Bottom 0.406: REL_5.1 18.42,5.51 19.7,6.79 19.7,11.76 28.1,20.16 28.1,25.99 26.73,27.36 26.73,27.71 v26.38,28.05
N$28  (via drill 0.5 pad 0.25)
  Top 0.406: U$2.3 25.16,27.17 v25.36,27.36
  Bottom 0.406: REL_6.1 15.91,5.4 17.13,6.62 17.13,10.22 27.41,20.5 27.41,25.65 25.7,27.36 v25.36,27.36
N$29  (via drill 0.5 pad 0.25)
  Top 0.406: v6.83,43.66 6.83,43.02 7.3,42.54 7.3,38.89 v7.14,38.73
  Bottom 0.406: R33.2 R34.1 9.74,39.05 7.46,39.05 v7.14,38.73 | R9.2 10.35,51.03 U$1.P$6 10.35,46.7 9.68,46.04 8.57,46.04 6.83,44.29 v6.83,43.66
N$30
  Top 0.406: U$2.5 21.84,25.57 20.56,26.85 20.56,30.28 17.64,33.19 11.58,33.19 10,34.77 10,35.86 8.21,37.65 8.21,45.02 6.5,46.74 4.51,46.74 RX2.1
N$34
  Bottom 0.813: U$3.ANT 17.17,46.87 16.61,47.42 16.61,53.94 15.78,54.77 ANT.1
N$35
  Bottom 0.406: IC2.2 8.9,23.59 7.41,25.08 R28.1
N$36
  Bottom 0.406: IC2.7 8.89,15.54 9.24,15.19 9.24,13.26 R29.1
N$37
  Bottom 0.406: IC2.6 10.16,15.13 10.78,14.5 10.78,13.25 R30.1
N$38  (via drill 0.5 pad 0.25)
  Top 0.406: v5.81,6.45 5.61,6.45 LED7.C
  Bottom 0.406: R29.2 9.21,9.84 v5.81,6.45
N$39  (via drill 0.5 pad 0.25)
  Top 0.406: v8.21,6.45 8.21,5.24 LED8.C
  Bottom 0.406: R30.2 10.8,9.03 v8.21,6.45
N$40  (via drill 0.5 pad 0.25)
  Top 0.61: R32.2 39.38,52.55 39.85,53.02 39.85,56.67 38.58,57.94 29.69,57.94 v25.4,53.66
  Bottom 0.61: U$3.CH_PD 21.13,52.56 22.22,53.66 v25.4,53.66
N$41
  Bottom 0.406: R36.2 R35.1 | R9.1 10.68,52.92 R36.2 | R36.2 12.38,50.91 11.64,50.17 11.64,48.81 U$1.P$7
N$42
  Bottom 0.406: R33.1 13.58,40.86 14.21,40.22 14.21,38.51 12.15,36.45 12.15,34.39 12.5,34.05 13.43,34.05 T3.1
N$43  (via drill 0.5 pad 0.25)
  Top 0.406: v7.87,36.28 6.19,37.95 6.19,41.43 6.5,41.74 v6.5,41.94
  Bottom 0.406: v7.87,36.28 7.87,34.73 8.72,33.88 10.78,33.88 11.98,32.68 14.9,32.68 | 14.9,32.68 15.75,33.53 15.75,34.88 T3.3 | R38.2 15.77,29.4 15.24,29.93 15.24,32.33 14.9,32.68 | v6.5,41.94 6.5,42.06 7.62,43.18 7.62,44.13 8.73,45.24 9.8,45.24 12.89,48.33 U$1.P$8 13.96,48.79 R39.1
N$44
  Top 0.406: T5.C 32.97,8.26 33.93,7.3 U$4.P$4
N$45
  Bottom 0.406: R37.2 13.04,43.81 U$1.P$1
N$46
  Top 0.406: T4.3 39.83,13.05 40.96,11.93 R40.2
N$47  (via drill 0.5 pad 0.25)
  Top 0.406: L1.2 28.26,41.75 26.67,43.34 24.92,43.34 22.54,45.72 17.46,45.72 v17.3,45.56
  Bottom 0.406: D1.A 9.92,35.76 9.92,36.79 9.07,37.65 9.05,37.62 6.67,37.62 6.19,38.1 6.19,39.05 8.72,41.59 10.35,43.22 U$1.P$3 10.35,44.64 12.06,46.36 13.49,46.36 14.13,45.72 17.14,45.72 v17.3,45.56
N$48
  Top 0.406: T5.B 32.24,12.75 R41.1
PGC  (via drill 0.5 pad 0.25)
  Top 0.406: U$2.16 28.41,24.59 v32.21,28.39 | v39.93,36.62 41.81,36.62 42.33,37.13 42.33,48.28 41.47,49.14 40.08,49.14 PGC.1
  Bottom 0.406: v32.21,28.39 39.93,36.11 v39.93,36.62
PGD  (via drill 0.5 pad 0.25)
  Top 0.406: U$2.17 29.21,24.02 v32.39,27.19
  Bottom 0.406: v32.39,27.19 42.33,37.13 42.33,45.71 41.3,46.74 40.07,46.74 PGD.1
POWER_DETECT  (via drill 0.5 pad 0.25)
  Top 0.406: T1.3 5.46,16.05 6.33,15.19 8.2,15.19 8.57,15.56 10.95,15.56 12.06,14.45 13.65,14.45 14.45,15.24 14.45,16.07 R2.1 | 14.62,16.22 R2.1 | R2.1 14.76,16.07 15.36,16.07 v15.56,15.87 | U$2.32 37.17,27.97 v37.47,28.26 | v31.11,11.59 30.16,11.59 28.1,9.53 17.3,9.53 16.99,9.84 16.99,12.22 v17.46,12.7
  Bottom 0.406: v31.11,11.59 33.02,9.68 39.85,9.68 40.64,10.48 40.64,26.19 39.37,27.46 38.26,27.46 v37.47,28.26 | v17.46,12.7 17.78,12.7 19.37,14.29 19.37,15.24 18.57,16.03 15.72,16.03 v15.56,15.87
PWR  (via drill 0.5 pad 0.25)
  Top 0.406: v25.56,44.93 R31.2 | v29.37,37.47 28.26,37.47 26.99,38.73 26.99,40.8 v26.19,41.59
  Bottom 0.406: v25.56,44.93 24.91,44.27 U$3.GPIO16 25.98,41.59 v26.19,41.59 | T2.3 30.33,38.42 v29.37,37.47
SCK  (via drill 0.5 pad 0.25)
  Top 0.406: J1.5 17.31,40.39 | 17.31,40.39 17.31,39.86 16.83,39.37 R13.2 | U$2.37 30.81,32.69 v26,37.5 | v16.19,40.32 17.25,40.32 17.31,40.39
  Bottom 0.406: v26,37.5 24.45,39.05 22.54,39.05 22.54,39.09 20.73,40.91 16.78,40.91 v16.19,40.32
SCL  (via drill 0.5 pad 0.25)
  Top 0.406: R19.1 18.06,28.45 U$6.P$8 19.27,27.04 v19.37,27.15 | U$2.14 26.81,24.15 26.05,24.91 v24.87,24.91
  Bottom 0.406: v24.87,24.91 21.6,24.91 v19.37,27.15
SDA
  Top 0.406: U$6.P$7 18.66,25.79 19.37,25.08 19.37,21.91 18.42,20.96 18.16,20.96 | 18.16,20.96 R14.1 | U$2.15 27.61,17.62 27.41,17.42 24.33,17.42 23.3,18.45 20.66,18.45 18.16,20.96
SDCS  (via drill 0.5 pad 0.25)
  Top 0.406: J1.2 20.61,40.03 20.95,39.69 20.95,39.05 | 20.95,39.05 R10.2 20.95,38.1 | U$2.11 21.14,20.76 v20.95,20.96 | v20,39.05 20.95,39.05
  Bottom 0.406: v20.95,20.96 20.21,21.7 20.21,22.9 17.78,25.34 17.78,28.36 18.5,29.08 20.82,29.08 21.91,30.16 21.91,34.77 20,36.67 v20,39.05
SDI  (via drill 0.5 pad 0.25)
  Top 0.406: J1.7 15.11,39.88 15,39.77 | 15,39.77 14.61,39.37 R11.2 14.75,38.16 | U$2.42 26.81,35.17 26.04,35.93 23.87,35.93 22.54,34.61 v20.48,34.61 | v15.72,37.15 15.72,39.06 15,39.77
  Bottom 0.406: v15.72,37.15 17.94,37.15 v20.48,34.61
SDO  (via drill 0.5 pad 0.25)
  Top 0.406: J1.3 19.52,39.84 19.05,39.37 19.05,39.05 | 19.05,39.05 R12.2 19.05,38.1 | U$2.43 26.01,32.73 v25.72,33.02 | v18.1,39.05 19.05,39.05
  Bottom 0.406: v18.1,39.05 18.1,39.69 18.73,40.32 20.32,40.32 21.27,39.37 21.27,37.47 v25.72,33.02
TGS_HEAT  (via drill 0.5 pad 0.25)
  Top 0.406: R41.2 32.46,15.09 v34.96,17.59 | v33.07,23.93 34.98,23.93 U$2.27
  Bottom 0.406: v34.96,17.59 34.96,22.05 v33.07,23.93
TGS_MEASURE  (via drill 0.5 pad 0.25)
  Top 0.406: R40.1 39.64,9.31 38.73,10.22 U$4.P$2 | U$2.26 36.25,23.17 v36.5,23.42
  Bottom 0.406: v36.5,23.42 36.84,23.42 39.41,20.85 39.41,11.79 U$4.P$2
TGS_PULSE  (via drill 0.5 pad 0.25)
  Top 0.406: T4.1 37.64,16.11 v37.36,16.39 | U$2.25 36.18,22.36 v36.33,22.22
  Bottom 0.406: v36.33,22.22 37.7,20.85 37.7,16.73 v37.36,16.39
VCC_3V  (via drill 0.5 pad 0.25)
  Top 0.406: R12.1 R10.1 R6.1 22.8,36.3 23.5,36.99 23.5,39.05 22.86,39.69 22.86,43.02 | R12.1 R13.1 16.77,36.35 14.61,36.35 R11.1 R16.1 | 15.41,29.4 R19.2 | U$6.P$1 14.7,27.04 | 14.7,27.04 13.87,27.88 13.87,29.08 14.21,29.42 15.39,29.42 R19.2 | IC1.3 11.93,24.27 13.33,25.67 | 13.33,25.67 14.7,27.04 | J1.4 18.42,43.91 19.18,44.68 22.7,44.68 22.86,44.52 22.86,43.02 | R15.2 34.71,16.14 35.81,17.25 35.81,19.96 U$2.23 32.47,20.76 32.04,21.19 32.04,24.45 32.36,24.76 U$2.28 36.35,24.76 v36.51,24.61 | v13.87,24.79 13.87,25.13 13.33,25.67 | R14.2 15.34,20.23 v16.1,19.48 14.43,17.8 R2.2 | R12.1 19.05,34.77 20.32,33.5 v20.95,33.5 | R19.2 15.4,29.41 15.4,29.85 15.88,30.32 18.73,30.32 v19.05,30 v19.05,28.26 | 22.86,43.02 23.18,42.7 26.35,42.7 30.03,39.02 31.04,39.02 R8.1 34.37,38.95 37.01,41.59 VCC.1 40.96,41.59 41.59,40.96 41.59,37.78 41.28,37.47 39.21,37.47 39.05,37.31 39.05,36.19 39.85,35.4 41.75,35.4 42.23,34.93 v42.23,32.7 | U$2.7 21.27,23.97 v21.11,23.81
  Bottom 0.406: v13.87,24.79 15.77,22.89 C1.1 16.1,20.31 v16.1,19.48 | v20.95,33.5 20.95,31.11 19.84,30 v19.05,30 | v21.11,23.81 20.8,23.81 18.57,26.04 18.57,27.78 v19.05,28.26 | v36.51,24.61 36.51,29.05 37.31,29.85 39.37,29.85 v42.23,32.7
VCC_5V  (via drill 0.5 pad 0.25)
  Top 0.406: U$4.P$3 34.44,10.62 T5.E 34.44,9.19
  Top 0.61: 34.44,9.19 35.3,9.19 36.16,8.33 36.16,6.27 33.58,3.7 14.38,3.7 14.04,4.04 14.04,9.02 14.9,9.87 14.9,12.79 17.64,15.53 17.64,15.58 18.42,16.35 18.42,19.27 v18.43,19.29
  Bottom 0.406: C5.1 12.17,31.11 11.12,32.16 9.95,32.16 D1.C
  Bottom 0.61: C5.1 13.7,31.07 13.7,29.76 14.07,29.39 R38.1 14.04,28.22 14.04,27.19 17.64,23.59 17.69,23.59 18.42,22.86 18.42,19.31 v18.43,19.29
WIFI_CONTROL  (via drill 0.5 pad 0.25)
  Top 0.406: U$2.35 32.41,32.53 v33.24,33.36
  Bottom 0.406: v33.24,33.36 34.96,35.08 34.96,37.68 R7.2